# EAGLE design usb_r2 (EAGLE 6.3)
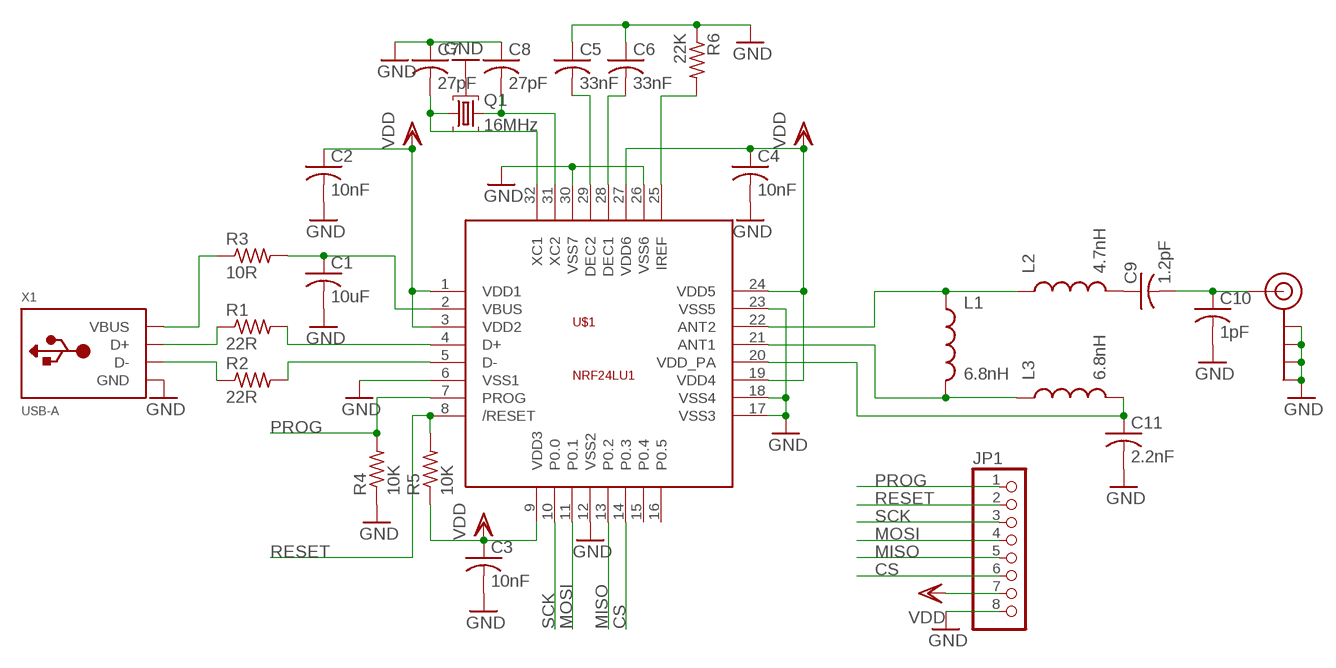
[diagram p0: schematic, sheet 1]

## Parts
C1  10uF  C-USC0805K  [C0805K]
C2  10nF  C-USC0402  [C0402]
C3  10nF  C-USC0402  [C0402]
C4  10nF  C-USC0402  [C0402]
C5  33nF  C-USC0402  [C0402]
C6  33nF  C-USC0402  [C0402]
C7  27pF  C-USC0402  [C0402]
C8  27pF  C-USC0402  [C0402]
C9  1.2pF  C-USC0402  [C0402]
C10  1pF  C-USC0402  [C0402]
C11  2.2nF  C-USC0402  [C0402]
J$1  SMA_EDGE  [SMA-EDGE]
JP1  PINHD-1X8  [1X08]
L1  6.8nH  INDUCTOR0402  [C0402]
L2  4.7nH  INDUCTOR0402  [C0402]
L3  6.8nH  INDUCTOR0402  [C0402]
Q1  16MHz  TSX-3225  [TSX-3225]
R1  22R  R-US_R0402  [R0402]
R2  22R  R-US_R0402  [R0402]
R3  10R  R-US_R0402  [R0402]
R4  10K  R-US_R0402  [R0402]
R5  10K  R-US_R0402  [R0402]
R6  22K  R-US_R0402  [R0402]
U$1  NRF24LU1  [QFN-32]
X1  USB-A  [MOLEX_480371000]

## Nets
CS: JP1.6 U$1.14(P0.3)
GND: C1.2 C2.2 C3.2 C4.2 C5.1 C6.1 C7.1 C8.1 C10.2 C11.2 J$1.GND@0(GND) J$1.GND@1(GND) J$1.GND@2(GND) J$1.GND@3(GND) JP1.8 Q1.2 Q1.4 R4.1 R6.1 U$1.6(VSS1) U$1.12(VSS2) U$1.17(VSS3) U$1.18(VSS4) U$1.23(VSS5) U$1.26(VSS6) U$1.30(VSS7) X1.4(GND)
MISO: JP1.5 U$1.13(P0.2)
MOSI: JP1.4 U$1.11(P0.1)
N$1: R1.1 X1.3(D+)
N$2: R2.1 X1.2(D-)
N$3: R1.2 U$1.4(D+)
N$4: R2.2 U$1.5(D-)
N$5: C5.2 U$1.29(DEC2)
N$6: R3.1 X1.1(VBUS)
N$7: C1.1 R3.2 U$1.2(VBUS)
N$8: C6.2 U$1.28(DEC1)
N$9: R6.2 U$1.25(IREF)
N$10: C8.2 Q1.3 U$1.31(XC2)
N$11: C7.2 Q1.1 U$1.32(XC1)
N$12: C9.1 L2.2
N$13: C9.2 C10.1 J$1.SIG(SIGNAL)
N$14: L1.1 L2.1 U$1.22(ANT2)
N$15: C11.1 L3.2 U$1.20(VDD_PA)
N$16: L1.2 L3.1 U$1.21(ANT1)
PROG: JP1.1 R4.2 U$1.7(PROG)
RESET: JP1.2 R5.2 U$1.8(/RESET)
SCK: JP1.3 U$1.10(P0.0)
VDD: C2.1 C3.1 C4.1 JP1.7 R5.1 U$1.1(VDD1) U$1.3(VDD2) U$1.9(VDD3) U$1.19(VDD4) U$1.24(VDD5) U$1.27(VDD6)
Unconnected: U$1.15(P0.4) U$1.16(P0.5)

## Library data of the parts
C1-C11 = adafruit:C-US: CAPACITOR, American symbol
J$1 = SparkFun:SMA_EDGE: SMA Antenna Connector End launch SMA connector. The paste layer has been removed so that the connector can be hand soldered onto the board after reflow.
JP1 = pinhead:PINHD-1X8: PIN HEADER
L1-L3 = SparkFun:INDUCTOR: Inductors Basic Inductor/Choke - 0603 and 1206. Footprints are not proven and vary greatly between part numbers.
Q1 = crystal:TSX-3225: TSX-3225 MHz Range Crystal Unit Miniature Size Low Profile SMD Frequency Range: 12MHz to 60MHz External Dimensions: 3.2 x 2.5 x 0.6 mm Overtone Order: Fundamental Applications: Mobile phone, Bluetooth, W-LAN ISM band radio, Clock for MPU Source: FA-238V / FA-238 / TSX-3225 Datasheet <http://www.eea.epson.com/portal/pls/portal/docs/1/1531444.PDF>
R1-R6 = adafruit:R-US_: RESISTOR, American symbol
U$1 = SparkFun:NRF24LU1
X1 = adafruit:USB-A: USB type A 'plug' Used for things that can directly connect to a USB port, say USB key

## Board
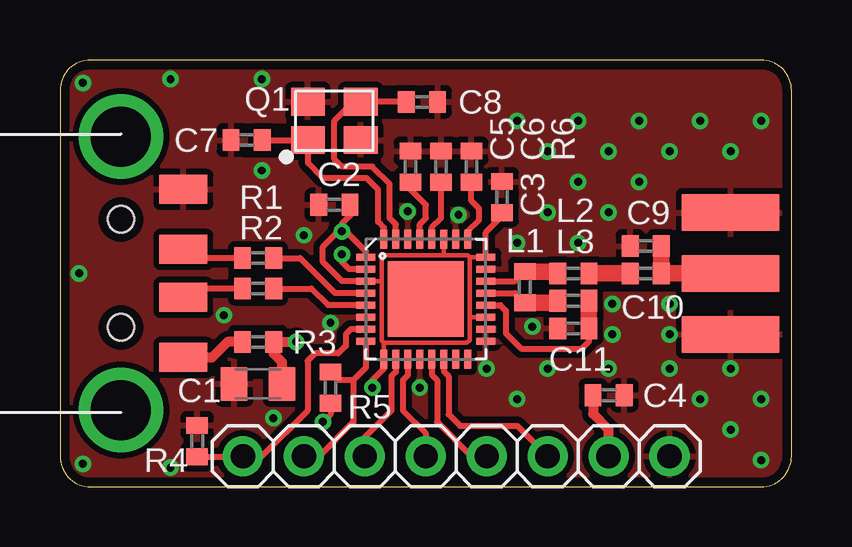
[diagram p1: board, top side]
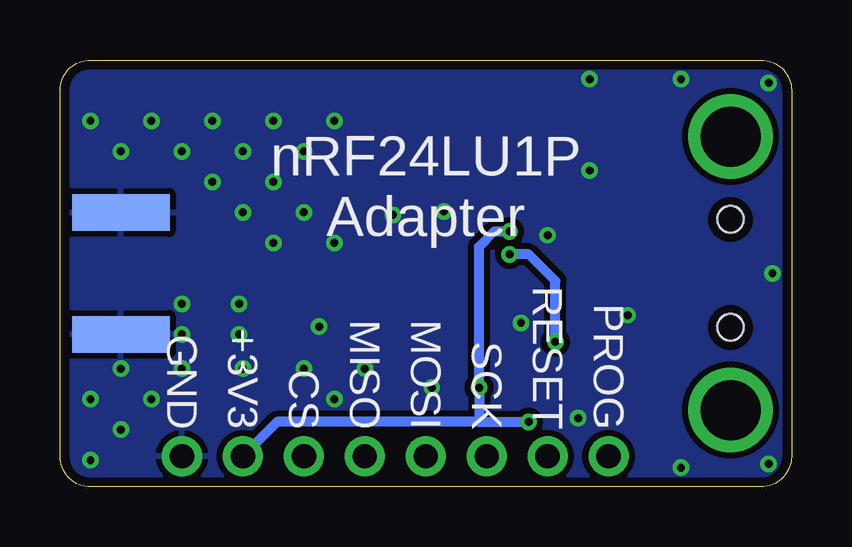
[diagram p2: board, bottom side, seen from below]

Size 30.48 x 17.78 mm. Coordinates in mm from the lower left corner, seen from the top.
Outline: 0,16.51 0,1.27 arc90 1.27,0 29.21,0 arc90 30.48,1.27 30.48,16.51 arc90 29.21,17.78 1.27,17.78 arc90 0,16.51
Copper layers (1*16): Top 0.0356mm / dielectric 1.5011mm / Bottom 0.0356mm
Design rules "LaenPCBOrder *": minimum track width 6mil, minimum drill 13mil, track to track 6mil, track to pad 6mil, pad to pad 6mil, via to via 6mil, smd to smd 6mil, copper to edge 15mil, drill to drill 6mil, minimum pad ring 7mil, minimum via ring 7mil, stop-mask expansion 4mil, vias tented up to drill 25mil, thermal gap 10mil
tRestrict: 16 lines

### Footprints (pad centres in the part's own frame; a part is rotated, then mirrored left to right if it is on the bottom)
C0805K = smd 1.1 x 1.4: 1 -1,0; 2 1,0
C0402 = smd 0.7 x 0.9: 1 -0.65,0; 2 0.65,0
SMA-EDGE = smd 1.524 x 4.064: GND@0 0,0; GND@1 5.08,0; SIG 2.54,0 | smd 1.524 x 4.064 bottom: GND@2 0,0; GND@3 5.08,0
1X08 = drill 1.016 pad 1.676: 1 -8.89,0; 2 -6.35,0; 3 -3.81,0; 4 -1.27,0; 5 1.27,0; 6 3.81,0; 7 6.35,0; 8 8.89,0
TSX-3225 = smd 1.4 x 1.15: 1 -1.1,-0.8; 2 1.1,-0.8; 3 1.1,0.8; 4 -1.1,0.8
R0402 = smd 0.7 x 0.9: 1 -0.65,0; 2 0.65,0
QFN-32 = smd 0.285 x 0.8: 1 -1.75,-2.5; 2 -1.25,-2.5; 3 -0.75,-2.5; 4 -0.25,-2.5; 5 0.25,-2.5; 6 0.75,-2.5; 7 1.25,-2.5; 8 1.75,-2.5; 17 1.75,2.5; 18 1.25,2.5; 19 0.75,2.5; 20 0.25,2.5; 21 -0.25,2.5; 22 -0.75,2.5; 23 -1.25,2.5; 24 -1.75,2.5 | smd 0.8 x 0.285: 9 2.5,-1.75; 10 2.5,-1.25; 11 2.5,-0.75; 12 2.5,-0.25; 13 2.5,0.25; 14 2.5,0.75; 15 2.5,1.25; 16 2.5,1.75; 25 -2.5,1.75; 26 -2.5,1.25; 27 -2.5,0.75; 28 -2.5,0.25; 29 -2.5,-0.25; 30 -2.5,-0.75; 31 -2.5,-1.25; 32 -2.5,-1.75 | smd 3.15 x 3.15: EP 0,0
MOLEX_480371000 = smd 1.2 x 2: 1 3.5,2.6; 2 1,2.6; 3 -1,2.6; 4 -3.5,2.6 | drill 2.5: M1 -5.7,0; M2 5.7,0 | hole 1.1: -2.25,0; 2.25,0

### Placement (x,y rotation side)
C1  8.26,4.29 180 top
C2  11.43,11.75 180 top
C3  18.41,12.06 90 top
C4  22.86,3.81 0 top
C5  14.61,13.34 270 top
C6  15.88,13.34 270 top
C7  7.78,14.45 0 top
C8  15.08,16.03 180 top
C9  24.41,8.88 0 top
C10  24.41,10.03 180 top
C11  21.39,6.59 180 top
J$1  27.94,6.34 90 top
JP1  16.51,1.27 0 top
L1  19.37,8.31 270 top
L2  21.39,8.88 0 top
L3  21.39,7.75 0 top
Q1  11.43,15.24 0 top
R1  8.26,9.53 0 top
R2  8.26,8.26 0 top
R3  8.26,6.03 0 top
R4  5.71,1.91 270 top
R5  11.27,4.13 90 top
R6  17.14,13.34 270 top
U$1  15.24,7.82 270 top
X1  2.54,8.89 270 top

### Tracks (layer width: path | path; a pad name or v marks a point on that pad's centre or on a via)
CS
  Top 0.254: JP1.6 19.05,2.54 16.67,2.54 16.19,3.02 16.19,4.6 15.99,4.81 U$1.14
GND  (via drill 0.33)
  other vias: 19.68,6.67 21.59,10.16 25.4,7.62 23.02,7.62 25.4,6.35 23.02,6.35 22.86,11.43 14.99,4.13 11.27,6.83 14.48,11.47 16.61,11.33 19.05,10.16 20.32,11.43 17.78,4.92 19.05,3.65 20.32,4.92 22.86,4.92 25.4,4.92 27.94,4.92 26.67,3.65 27.94,2.38 29.21,1.11 29.21,3.65 24.13,12.7 25.4,13.97 21.59,12.7 22.86,13.97 20.32,13.97 19.05,15.24 21.59,15.24 24.13,15.24 26.67,15.24 29.21,15.24 27.94,13.97 0.95,0.95 0.95,16.83 0.79,8.89 4.6,16.99 8.41,16.99 4.6,0.79 8.41,13.18 10.16,10.48 6.83,7.14 8.89,2.86
  pour Bottom (isolate 0.254): 0,0 30.48,0 30.48,17.78 0,17.78
  pour Top (isolate 0.254): 0,0 30.48,0 30.48,17.78 0,17.78
MISO
  Top 0.254: U$1.13 15.49,4.67 15.72,4.45 15.72,2.7 17.14,1.27 JP1.5
MOSI
  Top 0.254: U$1.11 14.49,4.65 14.29,4.45 14.29,3.17 15.24,2.22 JP1.4
N$1
  Top 0.254: R1.1 5.5,9.53 X1.3
N$2
  Top 0.254: R2.1 5.5,8.26 X1.2
N$3
  Top 0.254: R1.2 10,9.53 11.46,8.06 U$1.4
N$4
  Top 0.254: R2.2 10.48,8.26 11.17,7.57 U$1.5
N$5
  Top 0.254: U$1.29 14.99,10.94 15.24,11.19 15.24,11.75 14.61,12.38 C5.2
N$6
  Top 0.406: X1.1 6.34,5.39 6.99,6.03 R3.1
N$7  (via drill 0.33)
  Top 0.254: U$1.2 12.05,9.06 11.75,9.37 v11.75,9.68
  Top 0.406: C1.1 9.26,5.19 8.9,5.54 R3.2 v9.84,6.03
  Bottom 0.406: v9.84,6.03 9.84,8.57 10.95,9.68 v11.75,9.68
N$8
  Top 0.254: U$1.28 15.49,10.81 15.88,11.19 C6.2
N$9
  Top 0.254: U$1.25 16.99,10.64 17.46,11.11 17.46,11.59 17.14,11.91 R6.2
N$10
  Top 0.254: C8.2 Q1.3 12.22,16.03 11.43,15.24 11.43,13.65 11.75,13.34 13.02,13.34 13.73,12.62 13.73,11.19 13.99,10.93 U$1.31
N$11
  Top 0.254: C7.2 Q1.1 | Q1.1 | U$1.32 13.49,10.8 13.26,11.03 13.26,12.38 12.78,12.86 10.95,12.86 10.32,13.49 Q1.1
N$12
  Top 0.686: L2.2 C9.1
N$13
  Top 0.686: J$1.SIG C9.2 C10.1
N$14
  Top 0.254: U$1.22 18.97,8.56 L1.1
  Top 0.686: L1.1 20.66,8.96 L2.1
N$15
  Top 0.254: U$1.20 18.35,7.57 18.57,7.34 18.57,6.39 19.21,5.75 21.75,5.75 22.04,6.04 C11.1
  Top 0.686: L3.2 C11.1
N$16
  Top 0.254: U$1.21 18.97,8.06 L1.2
  Top 0.686: L1.2 20.66,7.67 L3.1
PROG
  Top 0.254: U$1.7 12.12,6.57 11.91,6.35 11.91,5.87 11.59,5.56 10.64,5.56 10.32,5.24 10.32,3.17 8.41,1.27 JP1.1 7.61,1.25 R4.2
RESET
  Top 0.254: U$1.8 12.74,4.96 12.22,4.45 | 12.22,4.45 12.22,2.7 10.79,1.27 JP1.2 | 12.22,4.45 11.6,4.45 R5.2
SCK
  Top 0.254: U$1.10 13.99,4.78 13.81,4.6 13.81,3.17 12.7,2.06 JP1.3
VDD  (via drill 0.33)
  Top 0.178: U$1.19 17.07,7.07 17.07,7.06 | 17.07,7.06 17.07,6.11 16.95,5.99 13.49,5.99 | 17.07,7.06 17.07,9.53 | 17.07,9.53 17.07,9.56 16.99,9.64 15.99,9.64 | U$1.24 17.11,9.56 17.07,9.53 | U$1.27 15.99,9.72 15.99,9.64 | U$1.3 13.34,8.56 13.41,8.49 | 13.41,8.49 13.41,6.07 13.49,5.99 | U$1.9 13.49,5.95 13.49,5.99 | 13.41,8.49 13.41,9.53 13.53,9.64 15.99,9.64
  Top 0.254: U$1.9 13.49,4.92 13.02,4.45 v13.02,4.13 | U$1.3 11.76,8.56 10.95,9.37 10.95,10 11.59,10.64 v11.75,10.64 | U$1.1 12.74,9.8 11.91,10.64 v11.75,10.64 | C2.1 12.08,11.29 11.75,10.95 v11.75,10.64 | U$1.24 17.74,10.6 18.41,11.27 C3.1 | R5.1 11.27,3.02 v10.95,2.7
  Top 0.406: JP1.7 22.86,2.38 22.21,3.03 C4.1
  Bottom 0.406: v11.75,10.64 12.38,10.64 13.02,10 v13.02,4.13 13.02,2.7 | 13.02,2.7 v10.95,2.7 | 13.02,2.7 21.43,2.7 JP1.7

### Text on the board
bNames: nRF24LU1P / Adapter | PROG | RESET | SCK | MOSI | MISO | CS | +3V3 | GND